# EAGLE design schematic (EAGLE 6.3)
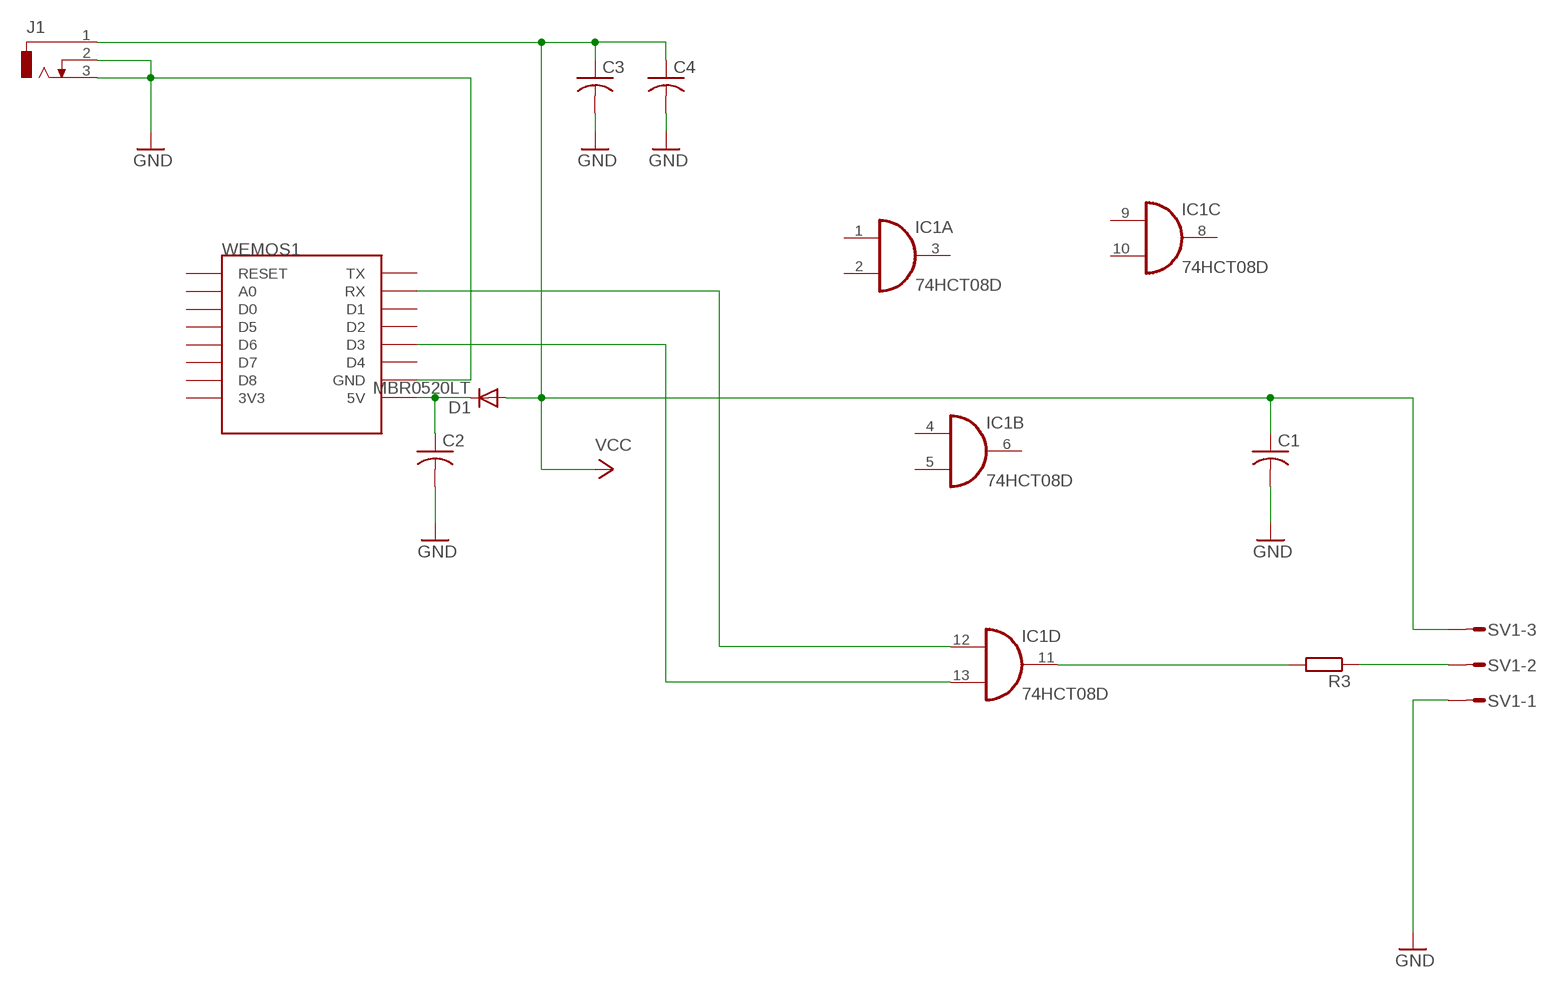
[diagram p0: schematic, sheet 1]

## Parts
C1  C-USC1206  [C1206]
C2  C-USC1206  [C1206]
C3  C-USC1206  [C1206]
C4  C-USC1206  [C1206]
D1  MBR0520LT  [SOD123]
IC1  74HCT08D  [SO14]
J1  DCJ0303  [DCJ0303]
R3  R-EU_M1206  [M1206]
SV1  S03P  [S03P]
WEMOS1  WEMOS-D1-MINI  [WEMOS-D1-MINI]

## Nets
GND: C1.2 C2.2 C3.2 C4.2 J1.2 J1.3 SV1.1 WEMOS1.GND
N$1: R3.1 SV1.2
N$2: C2.1 D1.C WEMOS1.5V
N$3: IC1.11(D:O) R3.2
N$4: IC1.12(D:I0) WEMOS1.RX
N$5: IC1.13(D:I1) WEMOS1.D3
VCC: C1.1 C3.1 C4.1 D1.A J1.1 SV1.3
Unconnected: IC1.1(A:I0) IC1.2(A:I1) IC1.3(A:O) IC1.4(B:I0) IC1.5(B:I1) IC1.6(B:O) IC1.8(C:O) IC1.9(C:I0) IC1.10(C:I1) WEMOS1.3V3 WEMOS1.A0 WEMOS1.D0 WEMOS1.D1 WEMOS1.D2 WEMOS1.D4 WEMOS1.D5 WEMOS1.D6 WEMOS1.D7 WEMOS1.D8 WEMOS1.RESET WEMOS1.TX

## Power pins joined to a net without a drawn wire
GND: IC1.7(P:GND)
VCC: IC1.14(P:VCC)

## Library data of the parts
C1-C4 = rcl:C-US: CAPACITOR, American symbol
D1 = diode:MBR0520LT: SCHOTTKY BARRIER RECTIFIER Source: http://onsemi.com .. MBR0520LT1-D.pdf
IC1 = 74xx-eu:74*08: Quad 2-input AND gate
J1 = con-jack:DCJ0303: DC POWER JACK Source: DCJ0303.pdf; OC_FARNELL: unknown; OC_NEWARK: unknown
R3 = resistor:R-EU_: RESISTOR, European symbol
SV1 = con-amp-mt:S03P: AMP MT CONNECTOR; OC_FARNELL: unknown; OC_NEWARK: unknown
WEMOS1 = esp8266modules:WEMOS-D1-MINI: WeMos.cc D1 mini ESP8266 module

## Board
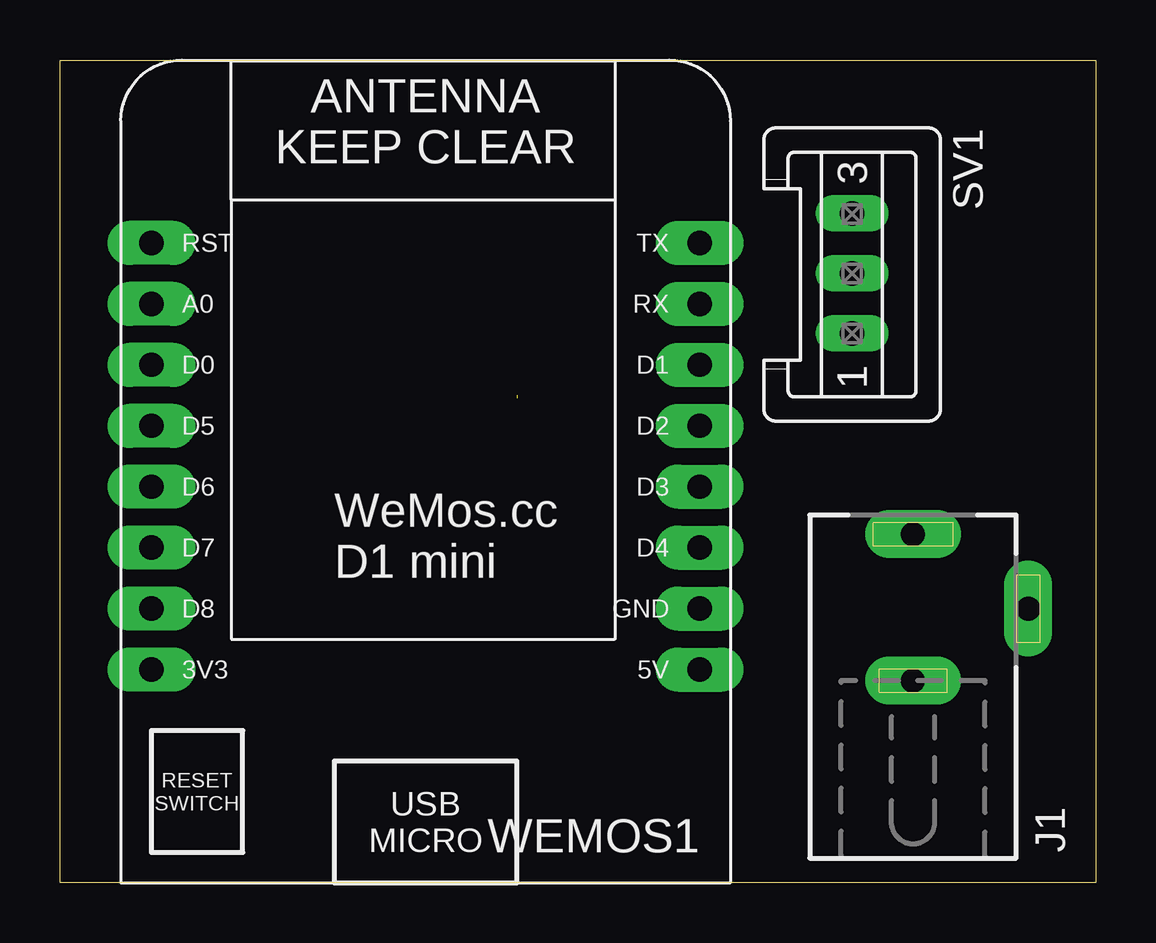
[diagram p1: board, top side]
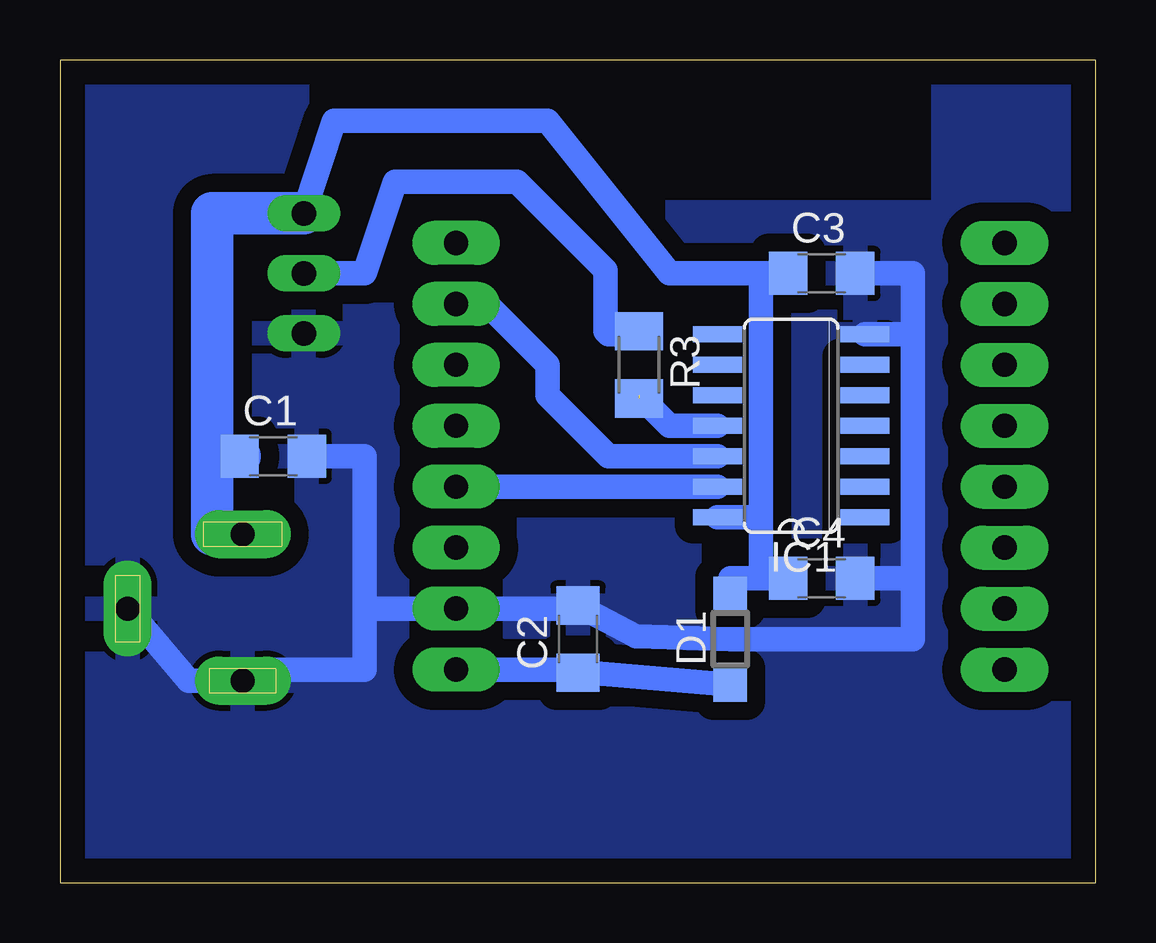
[diagram p2: board, bottom side, seen from below]

Size 43.18 x 34.29 mm. Coordinates in mm from the lower left corner, seen from the top.
Outline: 0,34.29 43.18,34.29 43.18,0 0,0 0,34.29
Copper layers (1*16): Top 0.035mm / dielectric 1.5mm / Bottom 0.035mm
Design rules "default": minimum track width 10mil, minimum drill 24mil, track to track 8mil, track to pad 8mil, pad to pad 8mil, via to via 8mil, smd to smd 8mil, copper to edge 40mil, drill to drill 8mil, minimum pad ring 10mil, minimum via ring 8mil, stop-mask expansion 4mil, vias tented up to drill 0mil, thermal gap 10mil

### Footprints (pad centres in the part's own frame; a part is rotated, then mirrored left to right if it is on the bottom)
C1206 = smd 1.6 x 1.8: 1 -1.4,0; 2 1.4,0
SOD123 = smd 1.4 x 1.4: A 1.9,0; C -1.9,0
SO14 = smd 0.66 x 2.032: 1 -3.81,-3.073; 2 -2.54,-3.073; 3 -1.27,-3.073; 4 0,-3.073; 5 1.27,-3.073; 6 2.54,-3.073; 7 3.81,-3.073; 8 3.81,3.073; 9 2.54,3.073; 10 1.27,3.073; 11 0,3.073; 12 -1.27,3.073; 13 -2.54,3.073; 14 -3.81,3.073
DCJ0303 = drill 1 pad 2 long: 1 0,3.1; 2 4.8,0; 3 0,-3
M1206 = smd 1.6 x 2: 1 -1.4,0; 2 1.4,0
S03P = drill 1.016 long: 1 2.5,0; 2 0,0; 3 -2.5,0
WEMOS-D1-MINI = drill 1.016 pad 1.829 long: 3V3 -10.16,-10.16; 5V 12.7,-10.16; A0 -10.16,5.08; D0 -10.16,2.54; D1 12.7,2.54; D2 12.7,0; D3 12.7,-2.54; D4 12.7,-5.08; D5 -10.16,0; D6 -10.16,-2.54; D7 -10.16,-5.08; D8 -10.16,-7.62; GND 12.7,-7.62; RESET -10.16,7.62; RX 12.7,5.08; TX 12.7,7.62

### Placement (x,y rotation side)
C1  34.29,17.78 0 bottom
C2  21.59,10.16 90 bottom
C3  11.43,25.4 0 bottom
C4  11.43,12.7 0 bottom
D1  15.24,10.16 90 bottom
IC1  12.7,19.05 90 bottom
J1  35.56,11.43 0 top
R3  19.05,21.59 270 bottom
SV1  33.02,25.4 270 top
WEMOS1  13.97,19.05 0 top

### Tracks (layer width: path | path; a pad name or v marks a point on that pad's centre or on a via)
GND
  Bottom 1.016: 21.59,11.43 C2.2 | 30.48,11.43 WEMOS1.GND 21.72,11.43 C2.2 | 30.48,11.43 30.48,8.89 35.56,8.89 J1.3 37.82,8.43 J1.2 | 7.62,12.7 C4.2 | 7.62,12.7 7.62,10.16 15.24,10.16 19.18,10.29 C2.2 | C3.2 7.62,25.4 7.62,22.86 | IC1.7 7.62,22.86 | 7.62,22.86 7.62,12.7 | 30.48,11.43 30.48,17.78 C1.2
  pour Bottom (isolate 0.762): 6.35,27.94 6.35,34.29 0,34.29 0,0 43.18,0 43.18,34.29 24.13,34.29 24.13,27.94
N$1
  Bottom 1.016: SV1.2 30.48,25.4 29.21,29.21 24.13,29.21 20.45,25.53 20.45,22.99 20.32,22.86 19.18,22.86 R3.1
N$2
  Bottom 1.016: D1.C 21.09,8.76 C2.1 21.72,8.89 WEMOS1.5V
N$3  (1 unrouted)
  Bottom 1.016: IC1.11 17.78,19.05 19.05,20.32
N$4
  Bottom 1.016: IC1.12 20.32,17.78 22.86,20.32 22.86,21.59 25.4,24.13 WEMOS1.RX
N$5
  Bottom 1.016: WEMOS1.D3 IC1.13
VCC
  Bottom 1.016: 13.97,12.7 C4.1 | 13.97,15.24 13.97,25.4 | C3.1 13.97,25.4 | 13.97,25.4 17.78,25.4 22.86,31.75 31.75,31.75 SV1.3 | IC1.14 13.97,15.24 | 13.97,15.24 13.97,12.7 | D1.A 15.24,12.7 13.97,12.7
  Bottom 1.778: SV1.3 36.83,27.9 36.83,17.78 | C1.1 36.83,17.78 | 36.83,17.78 36.83,14.53 J1.1